# EAGLE design BluJoy-e (EAGLE 9.6.2)
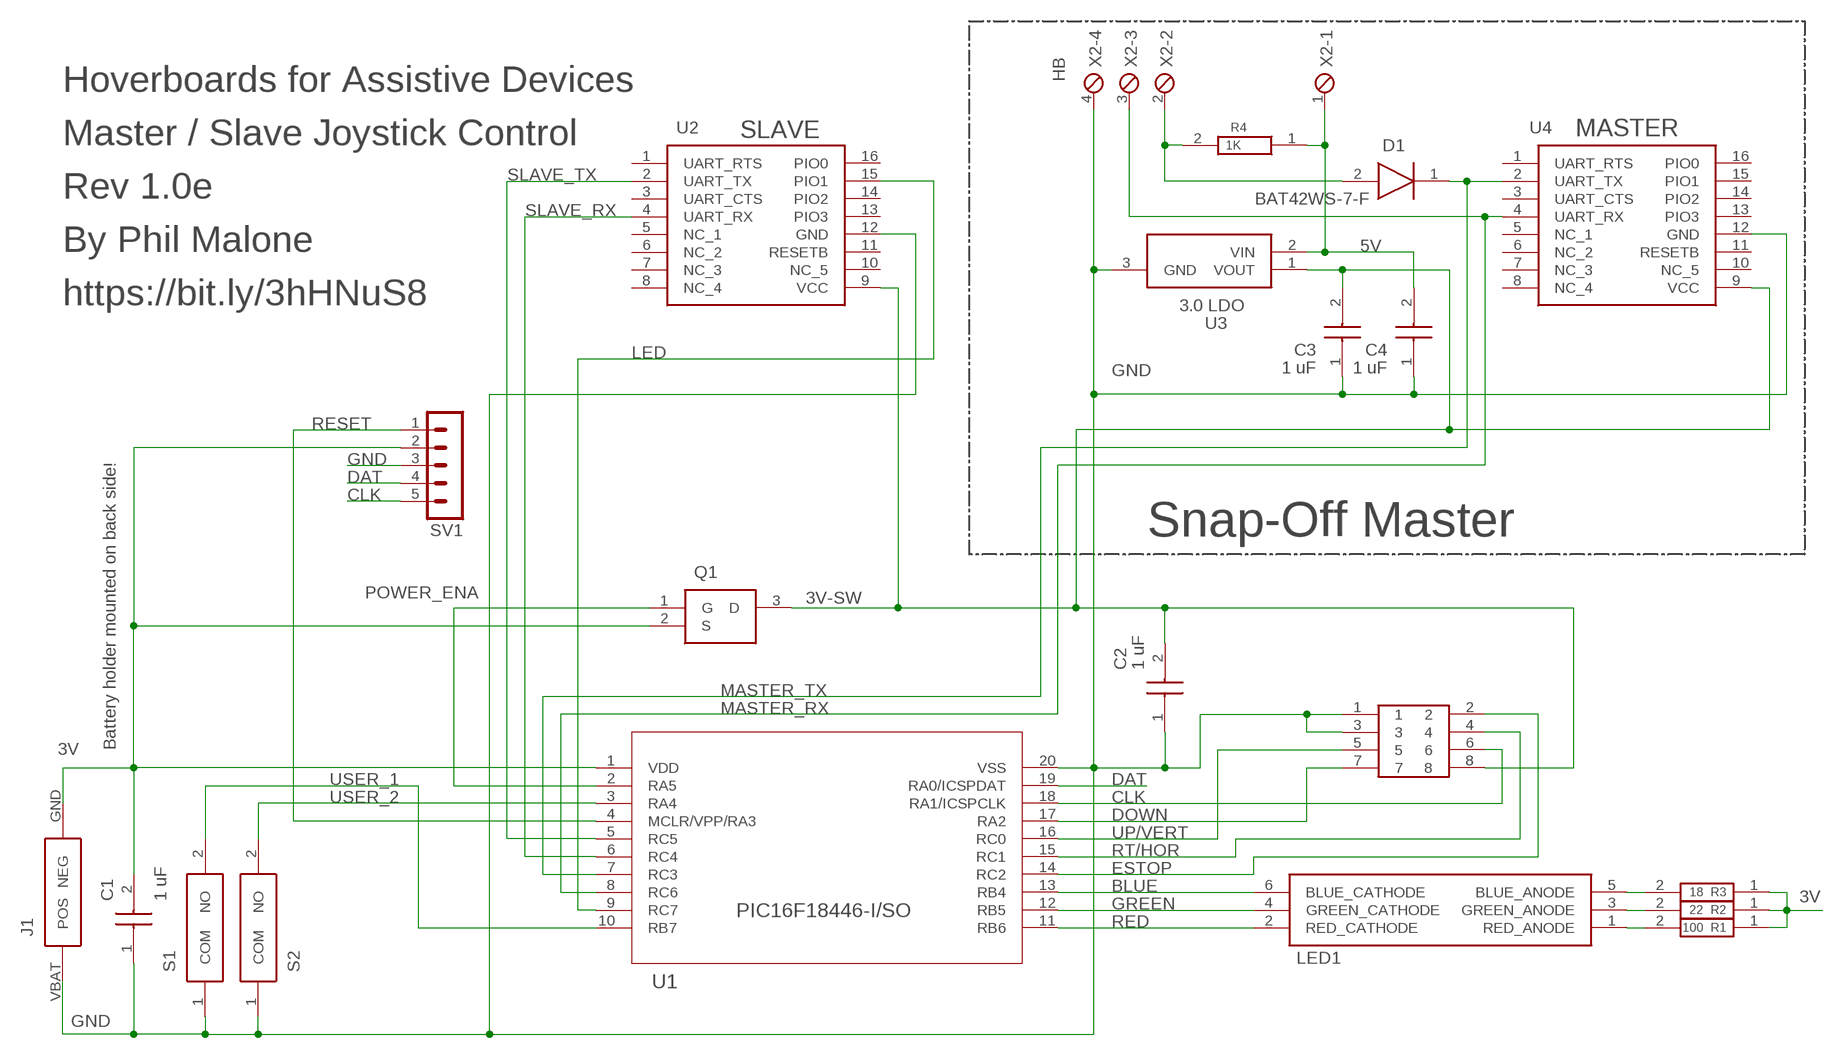
[diagram p0: schematic, sheet 1]

## Parts
C1  1 uF  CC0603KRX7R7BB104  [CAPC1608X90N]
C2  1 uF  CC0603KRX7R7BB104  [CAPC1608X90N]
C3  1 uF  CC0603KRX7R7BB104  [CAPC1608X90N]
C4  1 uF  CC0603KRX7R7BB104  [CAPC1608X90N]
D1  BAT42WS-7-F  [SOD2513X120N]
J1  2468  [2468]
LED1  ASMB-TTF0-0A20B  [ASMBTTF00A20B]
Q1  P-FET  NTR4171PT1G  [SOT96P237X111-3N]
R1  100  CRCW0603240RFKEB  [RESC1608X50N]
R2  22  CRCW0603240RFKEB  [RESC1608X50N]
R3  18  CRCW0603240RFKEB  [RESC1608X50N]
R4  1K  CRCW0603240RFKEB  [RESC1608X50N]
S1  PTS636_SK25J_SMTR_LFS  [PTS636SK25JSMTRLFS]
S2  PTS636_SK25J_SMTR_LFS  [PTS636SK25JSMTRLFS]
SV1  PICKIT  [MA05-1]
U1  PIC16F18446-I/SO  PIC16F15345-I/SO  [SOIC20_SO_MCH]
U2  HM-11  [HM-11-MODULE]
U3  3.0 LDO  MCP1812AT-030_TT  [SOT95P237X112-3N]
U4  HM-11  [HM-11-MODULE]
U$2  PHOENIX3.5X8-B  [1751303]
X2  HB  MPT4  [4POL254]

## Nets
3V: C1.2(C2) J1.GND(NEG) Q1.2(S) R1.1 R2.1 R3.1 SV1.2 U1.1(VDD)
3V-SW: C2.2(C2) C3.2(C2) Q1.3(D) U2.9(VCC) U3.1(VOUT) U4.9(VCC) U$2.8
5V: C4.2(C2) R4.1 U3.2(VIN) X2.1
BLUE: LED1.6(BLUE_CATHODE) U1.13(RB4)
CLK: SV1.5 U1.18(RA1/ICSPCLK) U$2.6
DAT: SV1.4 U1.19(RA0/ICSPDAT)
DOWN: U1.17(RA2) U$2.7
ESTOP: U1.14(RC2) U$2.2
GND: C1.1(C1) C2.1(C1) C3.1(C1) C4.1(C1) J1.VBAT(POS) S1.1(COM) S2.1(COM) SV1.3 U1.20(VSS) U2.12(GND) U3.3(GND) U4.12(GND) U$2.1 U$2.3 X2.4
GREEN: LED1.4(GREEN_CATHODE) U1.12(RB5)
LED: U1.9(RC7) U2.15(PIO1)
MASTER_RX: U1.8(RC6) U4.4(UART_RX) X2.3
MASTER_TX: D1.1(K) U1.7(RC3) U4.2(UART_TX)
N$1: D1.2(A) R4.2 X2.2
N$5: LED1.1(RED_ANODE) R1.2
N$6: LED1.3(GREEN_ANODE) R2.2
N$7: LED1.5(BLUE_ANODE) R3.2
POWER_ENA: Q1.1(G) U1.2(RA5)
RED: LED1.2(RED_CATHODE) U1.11(RB6)
RESET: SV1.1 U1.4(MCLR/VPP/RA3)
RT/HOR: U1.15(RC1) U$2.4
SLAVE_RX: U1.6(RC4) U2.4(UART_RX)
SLAVE_TX: U1.5(RC5) U2.2(UART_TX)
UP/VERT: U1.16(RC0) U$2.5
USER_1: S1.2(NO) U1.10(RB7)
USER_2: S2.2(NO) U1.3(RA4)
Unconnected: U2.1(UART_RTS) U2.3(UART_CTS) U2.5(NC_1) U2.6(NC_2) U2.7(NC_3) U2.8(NC_4) U2.10(NC_5) U2.11(RESETB) U2.13(PIO3) U2.14(PIO2) U2.16(PIO0) U4.1(UART_RTS) U4.3(UART_CTS) U4.5(NC_1) U4.6(NC_2) U4.7(NC_3) U4.8(NC_4) U4.10(NC_5) U4.11(RESETB) U4.13(PIO3) U4.14(PIO2) U4.15(PIO1) U4.16(PIO0)

## Notes on the sheet
- Hoverboards for Assistive Devices
- SLAVE | MASTER
- Master / Slave Joystick Control
- Rev 1.0e
- By Phil Malone
- https://bit.ly/3hHNuS8
- Snap-Off Master
- Battery holder mounted on back side!

## Library data of the parts
C1-C4 = BluJoy-e:CC0603KRX7R7BB104: CAPACITOR, 0603 100nF +/-10% 16V Source: Datasheet <http://componentsearchengine.com/Datasheets/1/CC0603KRX7R7BB104.pdf>; DESCRIPTION: CAPACITOR, 0603 100nF +/-10% 16V; HEIGHT: mm; MANUFACTURER_NAME: YAGEO (PHYCOMP); MANUFACTURER_PART_NUMBER: CC0603KRX7R7BB104; MOUSER_PART_NUMBER: 603-CC603KRX7R7BB104; MOUSER_PRICE-STOCK: https://www.mouser.com/Search/Refine.aspx?Keyword=603-CC603KRX7R7BB104; RS_PART_NUMBER: 6698763; RS_PRICE-STOCK: http://uk.rs-online.com/web/p/products/6698763
D1 = BluJoy-e:BAT42WS-7-F: DIODES INC. - BAT42WS-7-F - Small Signal Schottky Diode, Single, 30 V, 200 mA, 650 mV, 4 A, 125 C Source: Datasheet <https://componentsearchengine.com/Datasheets/2/BAT42WS-7-F.pdf>; ARROW_PART_NUMBER: BAT42WS-7-F; ARROW_PRICE-STOCK: https://www.arrow.com/en/products/bat42ws-7-f/diodes-incorporated; DESCRIPTION: DIODES INC. - BAT42WS-7-F - Small Signal Schottky Diode, Single, 30 V, 200 mA, 650 mV, 4 A, 125 C; HEIGHT: 1.2mm; MANUFACTURER_NAME: Diodes Inc.; MANUFACTURER_PART_NUMBER: BAT42WS-7-F; MOUSER_PART_NUMBER: 621-BAT42WS-F; MOUSER_PRICE-STOCK: https://www.mouser.co.uk/ProductDetail/Diodes-Incorporated/BAT42WS-7-F?qs=m4hD82FvRu0XtK2r8jLwYA%3D%3D
J1 = BluJoy-e:2468: Cylindrical Battery Contacts, Clips, Holders & Springs 2AAA PC MNT HOLDER Source: Datasheet <http://docs-emea.rs-online.com/webdocs/002e/0900766b8002ef75.pdf>; ALLIED_NUMBER: 70182756; ALLIED_PRICE-STOCK: http://www.alliedelec.com/keystone-electronics-2468/70182756/; DESCRIPTION: Cylindrical Battery Contacts, Clips, Holders & Springs 2AAA PC MNT HOLDER; HEIGHT: mm; MANUFACTURER_NAME: Keystone Electronics; MANUFACTURER_PART_NUMBER: 2468; MOUSER_PART_NUMBER: 534-2468; MOUSER_PRICE-STOCK: https://www.mouser.com/Search/Refine.aspx?Keyword=534-2468; RS_PART_NUMBER: 2794965; RS_PRICE-STOCK: http://uk.rs-online.com/web/p/products/2794965
LED1 = BluJoy-e:ASMB-TTF0-0A20B: BROADCOM LIMITED - ASMB-TTF0-0A20B - LED, RGB, 710/1840/410MCD, PLCC-6 Source: Datasheet <https://componentsearchengine.com/Datasheets/1/ASMB-TTF0-0A20B.pdf>; DESCRIPTION: BROADCOM LIMITED - ASMB-TTF0-0A20B - LED, RGB, 710/1840/410MCD, PLCC-6; HEIGHT: 2mm; MANUFACTURER_NAME: Avago Technologies; MANUFACTURER_PART_NUMBER: ASMB-TTF0-0A20B; MOUSER_PART_NUMBER: 630-ASMB-TTF0-0A20B; MOUSER_PRICE-STOCK: https://www.mouser.com/Search/Refine.aspx?Keyword=630-ASMB-TTF0-0A20B
Q1 = BluJoy-e:NTR4171PT1G: Power MOSFET Source: Datasheet <http://www.onsemi.com/pub/Collateral/NTR4171P-D.PDF>; ARROW_PART_NUMBER: NTR4171PT1G; ARROW_PRICE-STOCK: https://www.arrow.com/en/products/ntr4171pt1g/on-semiconductor; DESCRIPTION: Power MOSFET; HEIGHT: 1.11mm; MANUFACTURER_NAME: ON Semiconductor; MANUFACTURER_PART_NUMBER: NTR4171PT1G; MOUSER_PART_NUMBER: 863-NTR4171PT1G; MOUSER_PRICE-STOCK: https://www.mouser.co.uk/ProductDetail/ON-Semiconductor/NTR4171PT1G?qs=N5dOQkml4H8L27wHnYyw3w%3D%3D
R1-R4 = BluJoy-e:CRCW0603240RFKEB: Thick Film Resistors - SMD 1/10watt 240ohms 1% Source: Datasheet <http://www.vishay.com/docs/20035/dcrcwe3.pdf>; DESCRIPTION: Thick Film Resistors - SMD 1/10watt 240ohms 1%; HEIGHT: 0.5mm; MANUFACTURER_NAME: Vishay; MANUFACTURER_PART_NUMBER: CRCW0603240RFKEB; MOUSER_PART_NUMBER: 71-CRCW0603240RFKEB; MOUSER_PRICE-STOCK: https://www.mouser.com/Search/Refine.aspx?Keyword=71-CRCW0603240RFKEB
S1 S2 = BluJoy-e:PTS636_SK25J_SMTR_LFS: Tactile Switches Tact 50mA 12VDC, 6.0x3.5, 2.5mm H, 250gf, J leads, No ground pin, Red Actuator Source: Datasheet <https://www.mouser.com/datasheet/2/60/pts636-1550567.pdf>; DESCRIPTION: Tactile Switches Tact 50mA 12VDC, 6.0x3.5, 2.5mm H, 250gf, J leads, No ground pin, Red Actuator; HEIGHT: 2.7mm; MANUFACTURER_NAME: C & K COMPONENTS; MANUFACTURER_PART_NUMBER: PTS636 SK25J SMTR LFS; MOUSER_PART_NUMBER: 611-PTS636SK25JSMTRL; MOUSER_PRICE-STOCK: https://www.mouser.com/Search/Refine.aspx?Keyword=611-PTS636SK25JSMTRL
SV1 = BluJoy-e:PICKIT: PIN HEADER; OC_FARNELL: unknown; OC_NEWARK: unknown
U1 = BluJoy-e:PIC16F15345-I/SO; BUILT_BY: EMA_Cory; COPYRIGHT: Copyright (C) 2018 Accelerated Designs. All rights reserved; DATASHEET: http://ww1.microchip.com/downloads/en/DeviceDoc/PIC16-L-F15325-45-Data-Sheet-40001865D.pdf; MANUFACTURER_PART_NUMBER: PIC16F15345-I/SO; SOURCELIBRARY: Microchip_2020-03-04; VENDOR: Microchip
U2 U4 = BluJoy-e:HM-11: Bluetooth 4.0 BLE module Source: Datasheet <https://www.seeedstudio.com/wiki/images/c/cd/Bluetooth4_en.pdf>; ARROW_PART_NUMBER: HM-11; DESCRIPTION: Bluetooth 4.0 BLE module; HEIGHT: mm; MANUFACTURER_NAME: Huamao technology Co; MANUFACTURER_PART_NUMBER: HM-11
U3 = BluJoy-e:MCP1812AT-030_TT: LDO Voltage Regulators Ultra Low Iq LDO Source: Datasheet <https://mouser.componentsearchengine.com/Datasheets/1/MCP1812AT-030_TT.pdf>; ARROW_PART_NUMBER: MCP1812AT-030/TT; DESCRIPTION: LDO Voltage Regulators Ultra Low Iq LDO; HEIGHT: 1.12mm; MANUFACTURER_NAME: Microchip; MANUFACTURER_PART_NUMBER: MCP1812AT-030/TT; MOUSER_PART_NUMBER: 579-MCP1812AT-030/TT; MOUSER_PRICE-STOCK: https://www.mouser.co.uk/ProductDetail/Microchip-Technology/MCP1812AT-030-TT?qs=byeeYqUIh0Pab4jw7Ms6qQ%3D%3D
U$2 = BluJoy-e:PHOENIX3.5X8-B
X2 = BluJoy-e:MPT4: PHOENIX CONNECTOR; OC_FARNELL: unknown; OC_NEWARK: unknown

## Board
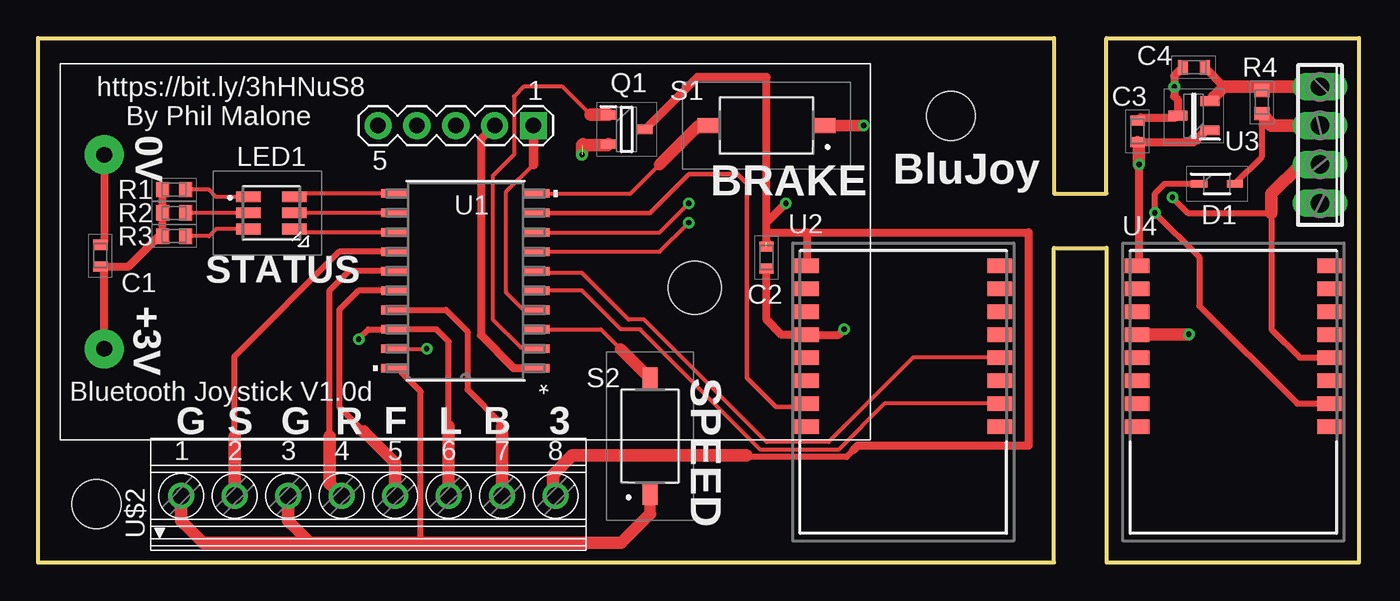
[diagram p1: board, top side]
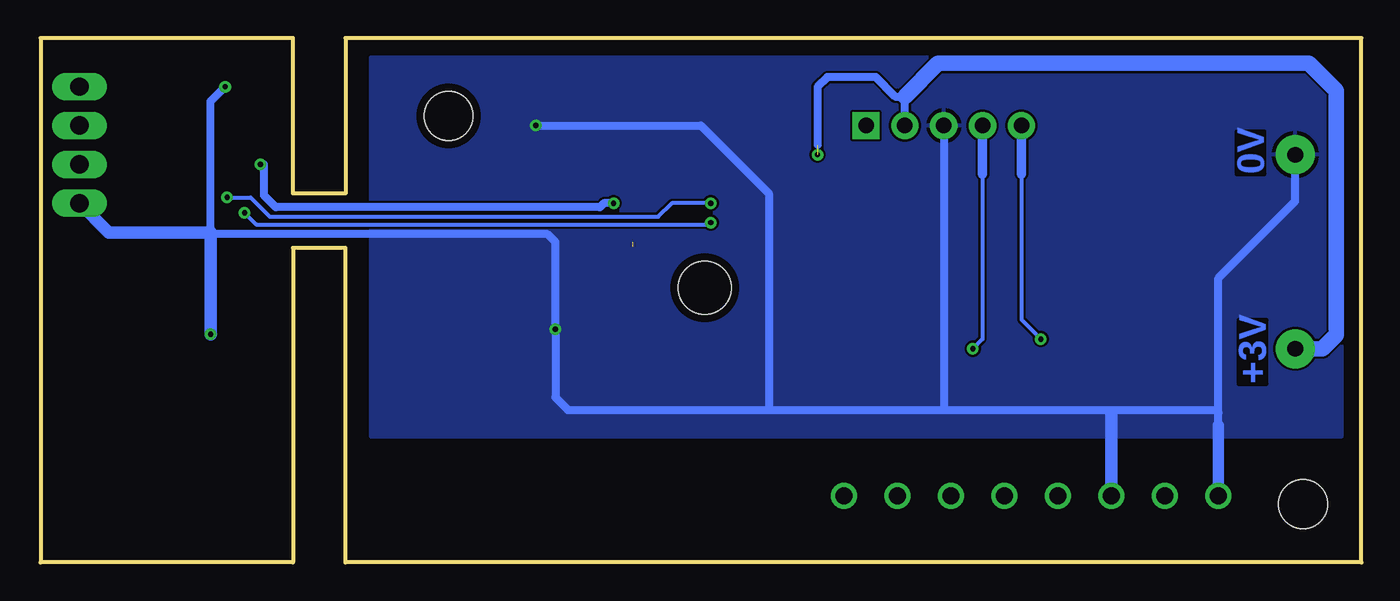
[diagram p2: board, bottom side, seen from below]

Size 86.36 x 34.29 mm. Coordinates in mm from the lower left corner, seen from the top.
Outline: 0,0 0,34.29 66.42,34.29 66.42,24.13 69.85,24.13 69.85,34.29 86.36,34.29 86.36,0 69.85,0 69.85,20.57 66.42,20.57 66.42,0 0,0
Copper layers (1*16): Top 0.035mm / dielectric 1.5mm / Bottom 0.035mm
Design rules "default *": minimum track width 6mil, minimum drill 0.35mm, track to track 6mil, track to pad 6mil, pad to pad 6mil, via to via 6mil, smd to smd 6mil, copper to edge 20mil, drill to drill 6mil, minimum pad ring 10mil, minimum via ring 8mil, stop-mask expansion 4mil, vias tented up to drill 0mil, thermal gap 10mil
Holes 3.17 mm at 3.81,3.81 59.69,29.21

### Footprints (pad centres in the part's own frame; a part is rotated, then mirrored left to right if it is on the bottom)
CAPC1608X90N = smd 0.66 x 0.94: 1 -0.711,0; 2 0.711,0
SOD2513X120N = smd 1.075 x 0.5: 1 -1.162,0; 2 1.162,0
2468 = drill 1.02 pad 2.54: GND 23.625,6.35; VBAT 23.625,-6.35 | hole 3.45: -14.985,2.35
ASMBTTF00A20B = smd 1.6 x 0.7: 1 -1.5,1.05; 2 1.5,1.05; 3 -1.5,0; 4 1.5,0; 5 -1.5,-1.05; 6 1.5,-1.05
SOT96P237X111-3N = smd 1 x 0.6: 1 -1.2,0.955; 2 -1.2,-0.955; 3 1.2,0
RESC1608X50N = smd 0.85 x 1: 1 -0.75,0; 2 0.75,0
PTS636SK25JSMTRLFS = smd 1.45 x 1: 1 -3.775,0; 2 3.775,0
MA05-1 = drill 1.016 pad 1.778 square: 1 -5.08,0 | drill 1.016 pad 1.778: 2 -2.54,0; 3 0,0; 4 2.54,0; 5 5.08,0
SOIC20_SO_MCH = smd 1.765 x 0.559: 1 -4.629,5.715; 2 -4.629,4.445; 3 -4.629,3.175; 4 -4.629,1.905; 5 -4.629,0.635; 6 -4.629,-0.635; 7 -4.629,-1.905; 8 -4.629,-3.175; 9 -4.629,-4.445; 10 -4.629,-5.715; 11 4.629,-5.715; 12 4.629,-4.445; 13 4.629,-3.175; 14 4.629,-1.905; 15 4.629,-0.635; 16 4.629,0.635; 17 4.629,1.905; 18 4.629,3.175; 19 4.629,4.445; 20 4.629,5.715
HM-11-MODULE = smd 1.6 x 0.95: 1 0,0; 2 0,-1.5; 3 0,-3; 4 0,-4.5; 5 0,-6; 6 0,-7.5; 7 0,-9; 8 0,-10.5; 9 12.6,-10.5; 10 12.6,-9; 11 12.6,-7.5; 12 12.6,-6; 13 12.6,-4.5; 14 12.6,-3; 15 12.6,-1.5; 16 12.6,0
SOT95P237X112-3N = smd 1.25 x 0.65: 1 -1.05,0.95; 2 -1.05,-0.95; 3 1.05,0
1751303 = drill 1.1 pad 1.7: 1 -12.25,-0.1; 2 -8.75,-0.1; 3 -5.25,-0.1; 4 -1.75,-0.1; 5 1.75,-0.1; 6 5.25,-0.1; 7 8.75,-0.1; 8 12.25,-0.1
4POL254 = drill 1.2 long: 1 -3.81,0; 2 -1.27,0; 3 1.27,0; 4 3.81,0

### Placement (x,y rotation side)
C1  4.06,20.07 270 top
C2  47.62,19.94 90 top
C3  71.88,28.19 270 top
C4  75.56,32.38 0 top
D1  77.09,24.77 0 top
J1  27.94,20.32 180 top
LED1  15.24,22.86 0 top
Q1  38.48,28.32 0 top
R1  8.89,24.38 0 top
R2  8.89,22.86 0 top
R3  8.89,21.34 0 top
R4  80.01,30.1 270 top
S1  47.62,28.57 180 top
S2  40.01,8.26 90 top
SV1  27.3,28.57 180 top
U1  27.94,18.41 180 top
U2  62.87,8.89 180 top
U3  75.56,29.21 180 top
U4  84.45,8.89 180 top
U$2  21.59,4.45 0 top
X2  83.82,27.3 270 top

### Tracks (layer width: path | path; a pad name or v marks a point on that pad's centre or on a via)
3V  (via drill 0.35)  (1 unrouted)
  Top 0.254: R3.1 8.14,21.59 R2.1 | 36.83,27.37 Q1.2
  Top 0.508: U1.1 31.11,12.7 28.96,14.86 28.96,27.69 SV1.2 | 35.62,27.37 36.83,27.37 | C1.2 4.45,19.36 | 4.45,19.36 5.91,19.36 8.14,21.59 | R3.1 R2.1 R1.1 | J1.GND 4.32,19.23 4.45,19.36
  Top 0.813: v35.56,26.67 35.56,27.3 | 35.62,27.37 35.56,27.3 | 35.56,27.3 37.22,27.3 Q1.2
  Bottom 0.508: SV1.2 29.84,30.48 30.48,30.48 31.75,31.75 34.92,31.75 35.56,31.11 35.56,27.3
  Bottom 1.016: J1.GND 2.54,13.97 1.65,14.86 1.65,30.86 3.43,32.64 27.69,32.64 29.84,30.48
3V-SW  (via drill 0.35)  (1 unrouted)
  Top 0.254: U3.1 75.84,27.48 75.56,27.48
  Top 0.381: 46.33,6.99 46.41,6.9 52.86,6.9 53.31,7.34
  Top 0.508: Q1.3 43.11,31.75 47.62,31.75 47.62,21.59 | v71.98,26.04 71.98,19.52 U4.9 | 53.31,7.34 53.59,7.62 64.77,7.62 64.77,21.59 50.27,21.59 | C2.2 47.62,21.59 | 47.62,20.95 47.62,22.23 v48.9,23.5 | 47.62,21.59 50.27,21.59 | 50.27,21.59 U2.9 | C3.2 75.56,27.48 76.34,28.26 U3.1
  Top 0.813: U$2.8 33.66,4.53 33.66,5.71 34.92,6.99 46.33,6.99 | C3.2 71.98,27.38 v71.98,26.04
  Bottom 0.508: v48.9,23.5 49.53,23.5 49.78,23.24 70.99,23.24 71.75,24 71.75,26.04 v71.98,26.04
5V
  Top 0.508: C4.2 77.55,31.11 77.57,31.11
  Top 0.61: X2.1 80.28,31.11 R4.1 | 77.55,31.11 77.55,31.09 76.89,30.43 U3.2
  Top 0.813: X2.1 79.74,31.11 | R4.1 79.74,31.11 | 79.74,31.11 77.57,31.11 76.89,30.43
BLUE
  Top 0.254: U1.13 16.96,21.59 LED1.6
CLK  (via drill 0.35)
  Top 0.381: v20.95,14.61 21.59,15.24 U1.18 26.04,15.24 26.84,14.44 26.84,8.89
  Top 0.813: U$2.6 26.84,8.89
  Bottom 0.254: 22.23,25.4 22.23,15.88 v20.95,14.61
  Bottom 0.61: SV1.5 22.23,25.4
DAT  (via drill 0.35)
  Top 0.254: U1.19 v25.4,13.97
  Bottom 0.254: 24.77,25.4 24.77,14.61 v25.4,13.97
  Bottom 0.61: SV1.4 24.77,25.4
DOWN
  Top 0.381: U1.17 26.67,16.51 28.07,15.11 28.07,11.3 30.34,9.03 30.34,8.89
  Top 0.813: U$2.7 30.34,8.89
ESTOP
  Top 0.381: U1.14 19.68,20.32 12.84,13.47 12.84,8.26
  Top 0.813: U$2.2 12.84,8.26
GND  (via drill 0.35)
  Top 0.254: 74.41,29.1 U3.3 | U1.20 23.5,12.7
  Top 0.381: 17.78,1.27 24.77,1.27 | 23.5,12.7 25.02,11.18 25.02,1.52 24.77,1.27 | 16.34,2.71 16.51,2.54 | 24.77,1.27 38.1,1.27
  Top 0.508: v52.7,15.24 52.35,14.89 U2.12 48.61,14.89 47.62,15.88 C2.1 | v74.3,31.11 74.35,31.11 | v74.3,31.11 74.3,30.48 74.52,30.26 U3.3 | C4.1 74.3,31.83 v74.3,31.11 | C3.1 72.08,29.1 74.41,29.1 | 9.34,2.73 9.53,2.54 | J1.VBAT 4.32,21.03 C1.1
  Top 0.762: 40.01,3.17 S2.1 | S1.1 v53.98,28.57
  Top 0.813: U4.12 71.89,14.92 v75.25,14.92 | U$2.1 9.34,2.73 | 9.53,2.54 10.79,1.27 17.78,1.27 | 17.78,1.27 38.1,1.27 40.01,3.17 | U$2.3 16.34,2.71 | 16.51,2.54 17.78,1.27
  Bottom 0.508: v74.3,31.11 75.25,30.16 75.25,21.59 75.25,21.46 53.21,21.46 52.7,20.95 v52.7,15.24 52.7,10.79 51.88,9.97 38.73,9.97 | 38.73,9.97 27.3,9.97 | 27.3,9.97 16.51,9.97 | 16.51,9.97 9.53,9.97 9.34,9.78 | v53.98,28.57 43.18,28.57 38.73,24.13 38.73,9.97 | SV1.3 27.3,9.97 | 9.34,8.95 9.34,9.78 | J1.VBAT 4.32,23.62 9.34,18.6 9.34,9.78 | 16.34,9.8 16.51,9.97
  Bottom 0.762: U$2.1 9.34,8.95
  Bottom 0.813: v75.25,14.92 75.25,21.46 | 75.25,21.59 81.92,21.59 X2.4 | U$2.3 16.34,9.8
  pour Bottom: 1.27,8.26 1.27,33.02 64.77,33.02 64.77,8.26
GREEN
  Top 0.254: U1.12 LED1.4
LED
  Top 0.305: U2.15 50.03,10.16 48.26,10.16 46.35,12.06 46.35,24.77 45.72,25.4 42.55,25.4 40.01,22.86 U1.9
MASTER_RX  (via drill 0.35)
  Top 0.254: v42.55,23.5 40.64,21.59 U1.8
  Top 0.406: v74.17,23.88 75.18,22.86 80.64,22.86 80.64,15.24 82.5,13.39 U4.4
  Top 0.813: X2.3 82.55,26.04 80.64,24.13 80.64,22.86
  Bottom 0.254: v42.55,23.5 45.09,23.5 45.97,22.61 71.37,22.61 72.64,23.88 v74.17,23.88
MASTER_TX  (via drill 0.35)
  Top 0.254: U4.2 84.22,10.16 | v42.55,22.23 40.64,20.32 U1.7
  Top 0.406: D1.1 73.66,24.77 73.03,24.13 v73.03,22.86 75.93,19.96 75.93,16.78 82.32,10.39 U4.2
  Bottom 0.254: v42.55,22.23 42.67,22.1 72.26,22.1 v73.03,22.86
N$1
  Top 0.406: 80.01,28.57 80.64,28.57 | 80.01,28.57 80.01,26.52 D1.2 | R4.2 80.01,28.57
  Top 0.813: X2.2 80.64,28.57 80.64,28.71 R4.2
N$5
  Top 0.254: LED1.1 11.65,23.91 11.18,24.38 R1.2
N$6
  Top 0.254: LED1.3 R2.2
N$7
  Top 0.254: LED1.5 11.65,21.81 11.18,21.34 R3.2
POWER_ENA
  Top 0.254: U1.2 32.49,14.05 31.57,14.05 29.72,15.9 29.72,25.27 31.11,26.67 31.11,30.48 31.75,31.11 34.29,31.11 36.13,29.28
  Top 0.813: Q1.1 36.13,29.28
RED
  Top 0.254: U1.11 16.96,24.13 LED1.2
RESET
  Top 0.254: U1.4 31.75,16.51 30.61,17.65 30.61,24.26 32.38,26.04
  Top 0.61: SV1.1 32.38,26.04
RT/HOR
  Top 0.381: 19.05,8.26 19.05,17.78 20.32,19.05 U1.15
  Top 0.813: U$2.4 19.05,5.13 19.05,8.26
SLAVE_RX
  Top 0.254: U2.4 57.2,13.39 51.69,7.87 47.62,7.87 39.62,15.88 38.61,15.88 35.56,18.92 33.15,18.92 33.02,19.05 U1.6
SLAVE_TX
  Top 0.254: U2.2 55.35,10.39 52.32,7.37 47.24,7.37 39.37,15.24 38.1,15.24 35.56,17.78 U1.5
UP/VERT
  Top 0.381: U1.16 20.95,17.78 19.68,16.51 19.68,10.16 21.27,8.57
  Top 0.813: 21.27,8.57 23.34,6.5 U$2.5
USER_1
  Top 0.254: U1.10 38.73,24.13 40.64,26.04
  Top 0.762: S1.2 43.18,28.57 40.64,26.04
USER_2
  Top 0.254: U1.3 36.8,15.24 38.08,13.95
  Top 0.762: S2.2 38.08,13.95

### Text on the board
Bottom: 0V | +3V
tPlace: https://bit.ly/3hHNuS8 | By Phil Malone | 0V | BluJoy | BRAKE | STATUS | +3V | SPEED | Bluetooth Joystick V1.0d | G S | G | R F L B | 3